# Altium schematic sheet ESP8266_COLOCK.SchDoc
size A4; SheetNumber: 1; SheetTotal: 1
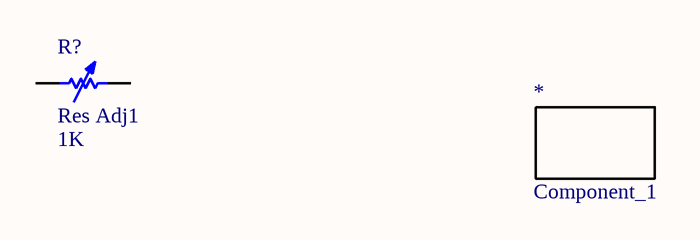
[diagram p0: ESP8266_COLOCK.SchDoc]

## Parts
*  Component_1
R?  Res Adj1  value 1K  [AXIAL-0.7]

## Nets

Not connected (* = marked no-connect by the designer): R? 1 2

## Library data of the parts
R? = Res Adj1: Variable Resistor; Set Position: 0.5; Published: 8-Jun-2000; LatestRevisionDate: 17-Jul-2002; LatestRevisionNote: Re-released for DXP Platform.; PackageReference: AXIAL-0.7; Publisher: Altium Limited; PackageDescription: Axial Device, Thru-Hole; 2 Leads; 0.7 in Pin Spacing